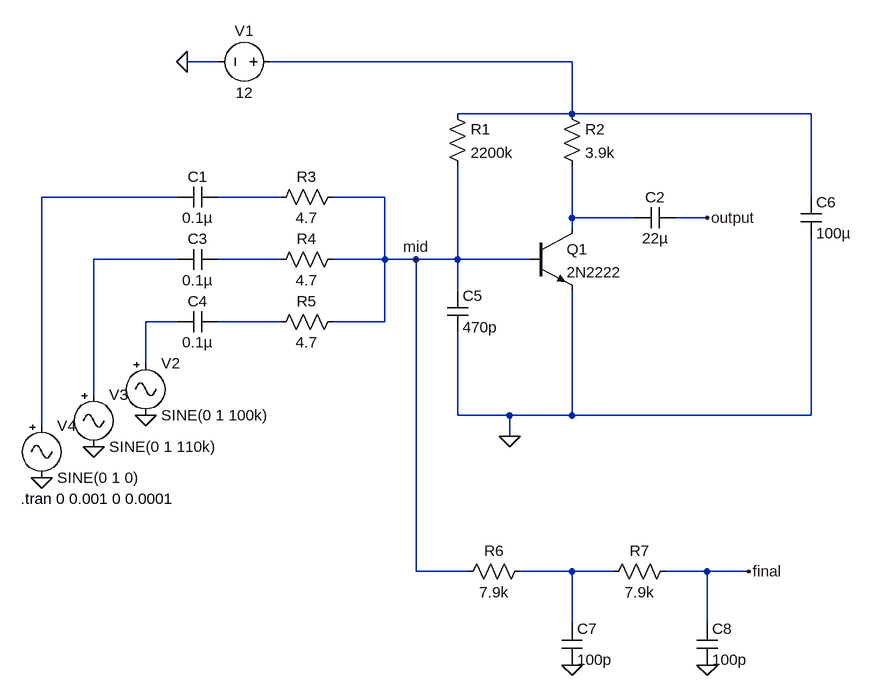
[diagram p0: schematic Draft1.asc]
Draft1.asc, the LTspice schematic file:
Version 4
SHEET 1 880 868
WIRE -768 -80 -816 -80
WIRE -224 -80 -688 -80
WIRE -224 0 -224 -80
WIRE -224 0 -400 0
WIRE 144 0 -224 0
WIRE -832 128 -1040 128
WIRE -672 128 -768 128
WIRE -512 128 -592 128
WIRE 144 128 144 0
WIRE -224 160 -224 80
WIRE -128 160 -224 160
WIRE -16 160 -64 160
WIRE -224 176 -224 160
WIRE -832 224 -960 224
WIRE -672 224 -768 224
WIRE -512 224 -512 128
WIRE -512 224 -592 224
WIRE -464 224 -512 224
WIRE -400 224 -400 80
WIRE -400 224 -464 224
WIRE -288 224 -400 224
WIRE -400 272 -400 224
WIRE -832 320 -880 320
WIRE -672 320 -768 320
WIRE -512 320 -512 224
WIRE -512 320 -592 320
WIRE -880 384 -880 320
WIRE -960 432 -960 224
WIRE -400 464 -400 336
WIRE -320 464 -400 464
WIRE -224 464 -224 272
WIRE -224 464 -320 464
WIRE 144 464 144 192
WIRE 144 464 -224 464
WIRE -1040 480 -1040 128
WIRE -320 496 -320 464
WIRE -464 704 -464 224
WIRE -384 704 -464 704
WIRE -224 704 -304 704
WIRE -160 704 -224 704
WIRE -16 704 -80 704
WIRE 48 704 -16 704
WIRE -224 784 -224 704
WIRE -16 784 -16 704
FLAG -816 -80 0
FLAG -320 496 0
FLAG -16 160 output
FLAG -880 464 0
FLAG -960 512 0
FLAG -1040 560 0
FLAG -464 224 mid
FLAG -224 848 0
FLAG -16 848 0
FLAG 48 704 final
SYMBOL res -416 -16 R0
SYMATTR InstName R1
SYMATTR Value 2200k
SYMBOL res -240 -16 R0
SYMATTR InstName R2
SYMATTR Value 3.9k
SYMBOL res -576 112 R90
WINDOW 0 0 56 VBottom 2
WINDOW 3 32 56 VTop 2
SYMATTR InstName R3
SYMATTR Value 4.7
SYMBOL res -576 208 R90
WINDOW 0 0 56 VBottom 2
WINDOW 3 32 56 VTop 2
SYMATTR InstName R4
SYMATTR Value 4.7
SYMBOL res -576 304 R90
WINDOW 0 0 56 VBottom 2
WINDOW 3 32 56 VTop 2
SYMATTR InstName R5
SYMATTR Value 4.7
SYMBOL npn -288 176 R0
SYMATTR InstName Q1
SYMATTR Value 2N2222
SYMBOL cap -768 112 R90
WINDOW 0 0 32 VBottom 2
WINDOW 3 32 32 VTop 2
SYMATTR InstName C1
SYMATTR Value 0.1µ
SYMBOL cap -64 144 R90
WINDOW 0 0 32 VBottom 2
WINDOW 3 32 32 VTop 2
SYMATTR InstName C2
SYMATTR Value 22µ
SYMBOL cap -768 208 R90
WINDOW 0 0 32 VBottom 2
WINDOW 3 32 32 VTop 2
SYMATTR InstName C3
SYMATTR Value 0.1µ
SYMBOL cap -768 304 R90
WINDOW 0 0 32 VBottom 2
WINDOW 3 32 32 VTop 2
SYMATTR InstName C4
SYMATTR Value 0.1µ
SYMBOL cap -416 272 R0
SYMATTR InstName C5
SYMATTR Value 470p
SYMBOL cap 128 128 R0
SYMATTR InstName C6
SYMATTR Value 100µ
SYMATTR SpiceLine V=16
SYMBOL voltage -672 -80 R90
WINDOW 0 -32 56 VBottom 2
WINDOW 3 32 56 VTop 2
WINDOW 123 0 0 Left 0
WINDOW 39 0 0 Left 0
SYMATTR InstName V1
SYMATTR Value 12
SYMBOL Misc\\signal -880 368 R0
WINDOW 123 0 0 Left 0
WINDOW 39 0 0 Left 0
SYMATTR InstName V2
SYMATTR Value SINE(0 1 100k)
SYMBOL Misc\\signal -960 416 R0
WINDOW 123 0 0 Left 0
WINDOW 39 0 0 Left 0
SYMATTR InstName V3
SYMATTR Value SINE(0 1 110k)
SYMBOL Misc\\signal -1040 464 R0
WINDOW 123 0 0 Left 0
WINDOW 39 0 0 Left 0
SYMATTR InstName V4
SYMATTR Value SINE(0 1 0)
SYMBOL cap -240 784 R0
SYMATTR InstName C7
SYMATTR Value 100p
SYMBOL cap -32 784 R0
SYMATTR InstName C8
SYMATTR Value 100p
SYMBOL res -288 688 R90
WINDOW 0 0 56 VBottom 2
WINDOW 3 32 56 VTop 2
SYMATTR InstName R6
SYMATTR Value 7.9k
SYMBOL res -64 688 R90
WINDOW 0 0 56 VBottom 2
WINDOW 3 32 56 VTop 2
SYMATTR InstName R7
SYMATTR Value 7.9k
TEXT -1072 592 Left 2 !.tran 0 0.001 0 0.0001

The netlist it stands for:
* Draft1.asc
R1 N001 mid 2200k
R2 N001 N004 3.9k
R3 mid N003 4.7
R4 mid N006 4.7
R5 mid N008 4.7
Q1 N004 mid 0 0 2N2222
C1 N003 N002 0.1µ
C2 output N004 22µ
C3 N006 N005 0.1µ
C4 N008 N007 0.1µ
C5 mid 0 470p
C6 N001 0 100µ V=16
V1 N001 0 12
V2 N007 0 SINE(0 1 100k)
V3 N005 0 SINE(0 1 110k)
V4 N002 0 SINE(0 1 0)
C7 N009 0 100p
C8 final 0 100p
R6 N009 mid 7.9k
R7 final N009 7.9k
.model NPN NPN
.model PNP PNP
.lib standard.bjt
.tran 0 0.001 0 0.0001
.backanno
.end